# Altium project FLETCHER - GPS HAT.PrjPcb
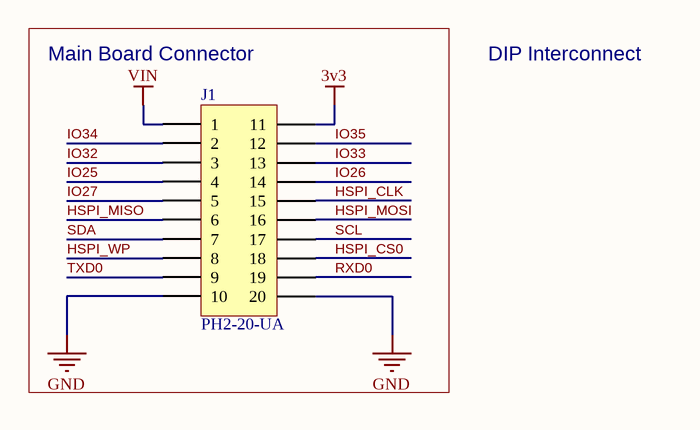
[diagram p0: HAT.SchDoc]
CAGE_CODE: ?????; CONTRACT_NUMBER: <CONTRACT NO>; DOC_NO_ASSY_DWG: <ASSY DWG NO>; DOC_NO_BOM: <BOM DOC NO>; DOC_NO_FAB_DWG: <FAB DWG NO>; DOC_NO_SCH_DWG: <SCH DWG NO>; PCB_2_DEC_TOL: +/-.01; PCB_3_DEC_TOL: +/-.010; PCB_ANG_TOL: +/-1/2; PCB_ASSEMBLY_NO: <PCB ASSY NO>; PCB_CHECKER: - -----; PCB_CHECKER_APP_DATE: --/--/----; PCB_DESIGNER: - -----; PCB_DESIGNER_APP_DATE: --/--/----; PCB_DWG_NO: <PCB DWG NO>; PCB_ENGINEER: - -----; PCB_ENGINEER_APP_DATE: --/--/----; PCB_PART_NUMBER: <PCB PN>; PCB_REV: A; SCH_REV: A
1 sheet, 1 parts. Net scope: global (net labels, ports and power ports of the same name join across sheets).
Board file: PCB1.PcbDoc

## Sheet HAT.SchDoc
size B; SheetNumber: 1; SheetTotal: 1

### Parts
J1  PH2-20-UA  [PH2-20-UA-BottomFootprint]

### Blocks framed on the sheet
Main Board Connector: J1

### Nets
3v3: J1.11
GND: J1.10 J1.20
VIN: J1.1
HSPI_CLK: J1.15
HSPI_CS0: J1.18
HSPI_MISO: J1.6
HSPI_MOSI: J1.16
HSPI_WP: J1.8
IO25: J1.4
IO26: J1.14
IO27: J1.5
IO32: J1.3
IO33: J1.13
IO34: J1.2
IO35: J1.12
RXD0: J1.19
SCL: J1.17
SDA: J1.7
TXD0: J1.9

### Notes on the sheet
- DIP Interconnect

### Library data of the parts
J1 = CMP-001-0232-1: Male Header 2 x 10 - 2.54mm Pitch; Pin Count: 20